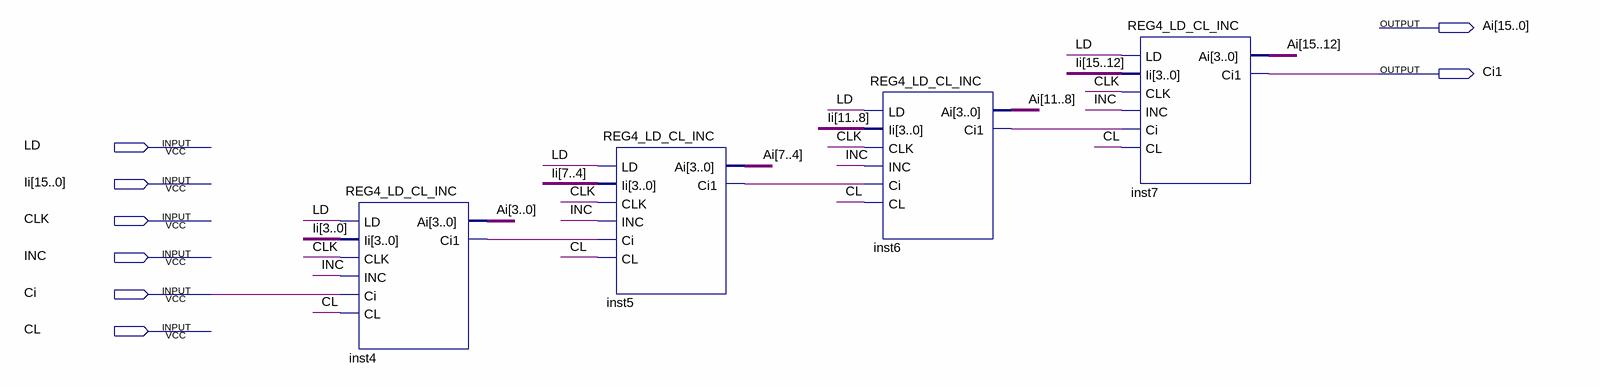
[diagram p0: schematic sheet]
// Quartus schematic REG16_LD_CL_INC.bdf as structural Verilog: 4 symbols, 8 pins
module REG16_LD_CL_INC (
  input  LD,
  input  [15:0] Ii,
  input  CLK,
  input  INC,
  input  Ci,
  input  CL,
  output [15:0] Ai,
  output Ci1
);

  wire inst4_ci1, inst5_ci1, inst6_ci1;

  REG4_LD_CL_INC inst4 (.LD(LD), .Ii(Ii[3:0]), .CLK(CLK), .INC(INC), .Ci(Ci), .CL(CL), .Ai(Ai[3:0]), .Ci1(inst4_ci1));
  REG4_LD_CL_INC inst5 (
    .LD(LD), .Ii(Ii[7:4]), .CLK(CLK), .INC(INC), .Ci(inst4_ci1), .CL(CL), .Ai(Ai[7:4]), .Ci1(inst5_ci1));
  REG4_LD_CL_INC inst6 (
    .LD(LD), .Ii(Ii[11:8]), .CLK(CLK), .INC(INC), .Ci(inst5_ci1), .CL(CL), .Ai(Ai[11:8]), .Ci1(inst6_ci1));
  REG4_LD_CL_INC inst7 (
    .LD(LD), .Ii(Ii[15:12]), .CLK(CLK), .INC(INC), .Ci(inst6_ci1), .CL(CL), .Ai(Ai[15:12]), .Ci1(Ci1));
endmodule
